# EAGLE design shield (EAGLE 8.4.0)
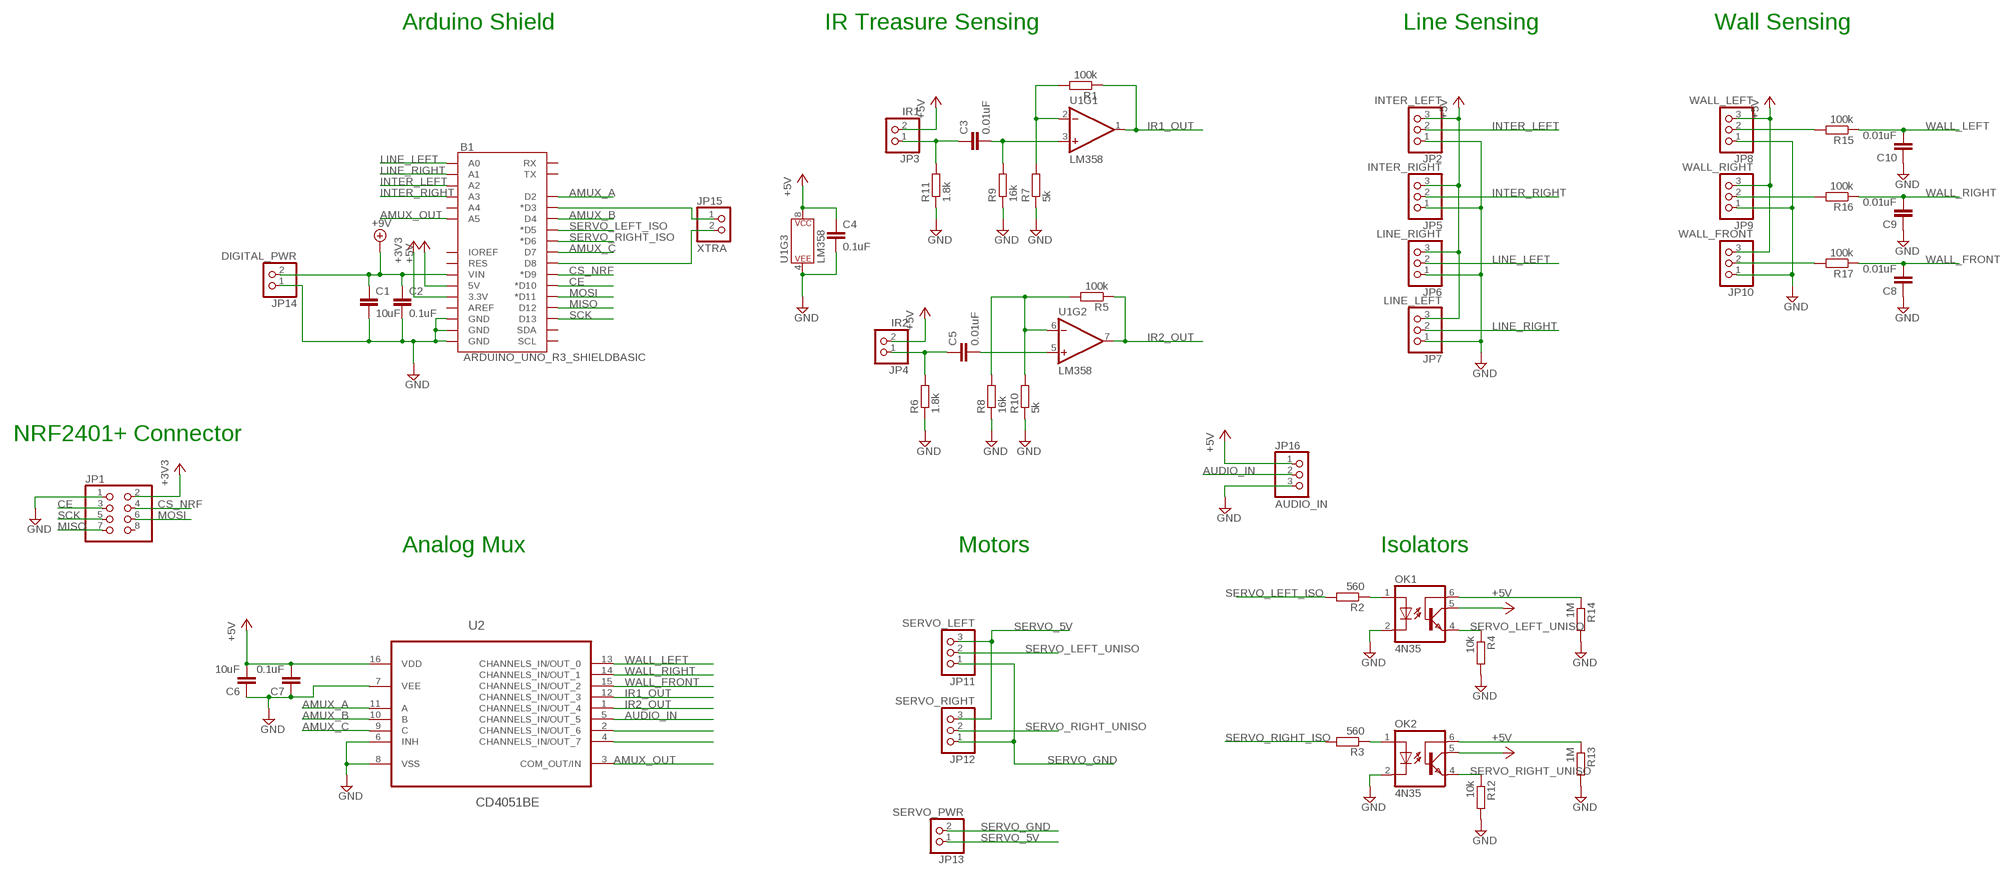
[diagram p0: schematic, sheet 1]

## Parts
B1  ARDUINO_UNO_R3_SHIELDBASIC  [UNO_R3_SHIELD]
C1  10uF  C5/3  [C5B3]
C2  0.1uF  C5/3  [C5B3]
C3  0.01uF  C5/3  [C5B3]
C4  0.1uF  C2.5/2  [C2.5-2]
C5  0.01uF  C5/3  [C5B3]
C6  10uF  C5/3  [C5B3]
C7  0.1uF  C5/3  [C5B3]
C8  0.01uF  C5/3  [C5B3]
C9  0.01uF  C5/3  [C5B3]
C10  0.01uF  C5/3  [C5B3]
JP1  PINHD-2X4  [2X04]
JP2  INTER_LEFT  PINHD-1X3  [1X03]
JP3  IR1  PINHD-1X2  [1X02]
JP4  IR2  PINHD-1X2  [1X02]
JP5  INTER_RIGHT  PINHD-1X3  [1X03]
JP6  LINE_RIGHT  PINHD-1X3  [1X03]
JP7  LINE_LEFT  PINHD-1X3  [1X03]
JP8  WALL_LEFT  PINHD-1X3  [1X03]
JP9  WALL_RIGHT  PINHD-1X3  [1X03]
JP10  WALL_FRONT  PINHD-1X3  [1X03]
JP11  SERVO_LEFT  PINHD-1X3  [1X03]
JP12  SERVO_RIGHT  PINHD-1X3  [1X03]
JP13  SERVO_PWR  PINHD-1X2  [1X02]
JP14  DIGITAL_PWR  PINHD-1X2  [1X02]
JP15  XTRA  PINHD-1X2  [1X02]
JP16  AUDIO_IN  PINHD-1X3  [1X03]
OK1  4N35  [DIL06]
OK2  4N35  [DIL06]
R1  100k  R-EU_VMTA55  [VMTA55]
R2  560  R-EU_VMTA55  [VMTA55]
R3  560  R-EU_VMTA55  [VMTA55]
R4  10k  R-EU_VMTA55  [VMTA55]
R5  100k  R-EU_VMTA55  [VMTA55]
R6  1.8k  R-EU_VMTA55  [VMTA55]
R7  5k  R-EU_VMTA55  [VMTA55]
R8  16k  R-EU_VMTA55  [VMTA55]
R9  16k  R-EU_VMTA55  [VMTA55]
R10  5k  R-EU_VMTA55  [VMTA55]
R11  1.8k  R-EU_VMTA55  [VMTA55]
R12  10k  R-EU_VMTA55  [VMTA55]
R13  1M  R-EU_VMTA55  [VMTA55]
R14  1M  R-EU_VMTA55  [VMTA55]
R15  100k  R-EU_VMTA55  [VMTA55]
R16  100k  R-EU_VMTA55  [VMTA55]
R17  100k  R-EU_VMTA55  [VMTA55]
U1  LM358  [DIP08]
U2  CD4051BE  [DIP254P762X508-16]

## Nets
+3V3: B1.3.3V JP1.2
+5V: B1.5V C4.1 C6.2 C7.2 JP2.3 JP3.2 JP4.2 JP5.3 JP6.3 JP7.3 JP8.3 JP9.3 JP10.3 JP16.1 OK1.5(COL) OK2.5(COL) U1.8(P$V+) U2.16(VDD)
AMUX_A: B1.D2 U2.11(A)
AMUX_B: B1.D4 U2.10(B)
AMUX_C: B1.D7 U2.9(C)
AMUX_OUT: B1.A5 U2.3(COM_OUT/IN)
AUDIO_IN: JP16.2 U2.5(CHANNELS_IN/OUT_5)
CE: B1.D10(*D10) JP1.3
CS_NRF: B1.D9(*D9) JP1.4
GND: B1.GND@0(GND) B1.GND@1(GND) B1.GND@2(GND) C1.2 C2.2 C4.2 C6.1 C7.1 C8.1 C9.1 C10.1 JP1.1 JP2.1 JP5.1 JP6.1 JP7.1 JP8.1 JP9.1 JP10.1 JP14.1 JP16.3 OK1.2(C) OK2.2(C) R4.2 R6.1 R7.1 R8.1 R9.1 R10.1 R11.1 R12.2 R13.2 R14.2 U1.4(P$V-) U2.6(INH) U2.7(VEE) U2.8(VSS)
INTER_LEFT: B1.A2 JP2.2
INTER_RIGHT: B1.A3 JP5.2
IR1_OUT: R1.1 U1.1(OUT) U2.12(CHANNELS_IN/OUT_3)
IR2_OUT: R5.1 U1.7(OUT) U2.1(CHANNELS_IN/OUT_4)
LINE_LEFT: B1.A0 JP6.2
LINE_RIGHT: B1.A1 JP7.2
MISO: B1.D12 JP1.7
MOSI: B1.D11(*D11) JP1.6
N$1: C3.1 JP3.1 R11.2
N$2: B1.VIN C1.1 C2.1 JP14.2 ; supply symbol labelled +9V
N$3: C3.2 R9.2 U1.3(+IN)
N$4: R1.2 R7.2 U1.2(-IN)
N$5: C5.1 JP4.1 R6.2
N$6: C5.2 U1.5(+IN)
N$7: R5.2 R8.2 R10.2 U1.6(-IN)
N$8: OK1.6(BAS) R14.1
N$9: B1.D3(*D3) JP15.1
N$10: OK2.1(A) R3.1
N$11: OK1.1(A) R2.1
N$12: B1.D8 JP15.2
N$13: JP8.2 R15.2
N$14: OK2.6(BAS) R13.1
N$16: U2.2(CHANNELS_IN/OUT_6)
N$17: U2.4(CHANNELS_IN/OUT_7)
N$18: JP9.2 R16.2
N$19: JP10.2 R17.2
SCK: B1.D13 JP1.5
SERVO_5V: JP11.3 JP12.3 JP13.1
SERVO_GND: JP11.1 JP12.1 JP13.2
SERVO_LEFT_ISO: B1.D5(*D5) R2.2
SERVO_LEFT_UNISO: JP11.2 OK1.4(EMI) R4.1
SERVO_RIGHT_ISO: B1.D6(*D6) R3.2
SERVO_RIGHT_UNISO: JP12.2 OK2.4(EMI) R12.1
WALL_FRONT: C8.2 R17.1 U2.15(CHANNELS_IN/OUT_2)
WALL_LEFT: C10.2 R15.1 U2.13(CHANNELS_IN/OUT_0)
WALL_RIGHT: C9.2 R16.1 U2.14(CHANNELS_IN/OUT_1)
Unconnected: B1.A4 B1.AREF B1.IOREF B1.RES B1.RX B1.SCL B1.SDA B1.TX JP1.8

## Notes on the sheet
- Arduino Shield | IR Treasure Sensing | Line Sensing | Wall Sensing
- NRF2401+ Connector
- Analog Mux | Motors | Isolators

## Library data of the parts
B1 = SparkFun-Boards:ARDUINO_UNO_R3_SHIELD: Arduino R3 Shield Footprint Shield form compatible with the Arduino Uno R3. SparkFun Products: MG2639 Cellular Shield <https://www.sparkfun.com/products/13120> MIDI Shield <https://www.sparkfun.com/products/12898> R3 Stackable Headers Kit <https://www.sparkfun.com/products/11417>
C1-C10 = capacitor-wima:C: CAPACITOR naming: grid - package width
JP1 = pinhead:PINHD-2X4: PIN HEADER
JP2 JP5-JP12 JP16 = pinhead:PINHD-1X3: PIN HEADER
JP3 JP4 JP13-JP15 = pinhead:PINHD-1X2: PIN HEADER
OK1 OK2 = optocoupler:4N35: MOTOROLA OPTO COUPLER; MF: FAIRCHILD SEMICONDUCTOR; MPN: 4N35; OC_FARNELL: 1328375; OC_NEWARK: 72K9946
R1-R17 = resistor:R-EU_: RESISTOR, European symbol
U1 = SparkFun-IC-Amplifiers:LM358: LM358 Jellybean op-amp Datasheet <http://www.sparkfun.com/datasheets/Components/General/LM358.pdf> SparkFun Products Op-Amp (Thru-Hole) - LM358 <https://www.sparkfun.com/products/9456> (COM-09456); PROD_ID: IC-09172
U2 = Texas Instruments_By_element14_Batch_1:CD4051BE: The CD4051B is a single 8-Channel multiplexer having three binary control inputs.; MPN: CD4051BE; OC_FARNELL: 1106109; OC_NEWARK: 60K5119; PACKAGE: PDIP-16; SUPPLIER: Texas Instruments

## Board
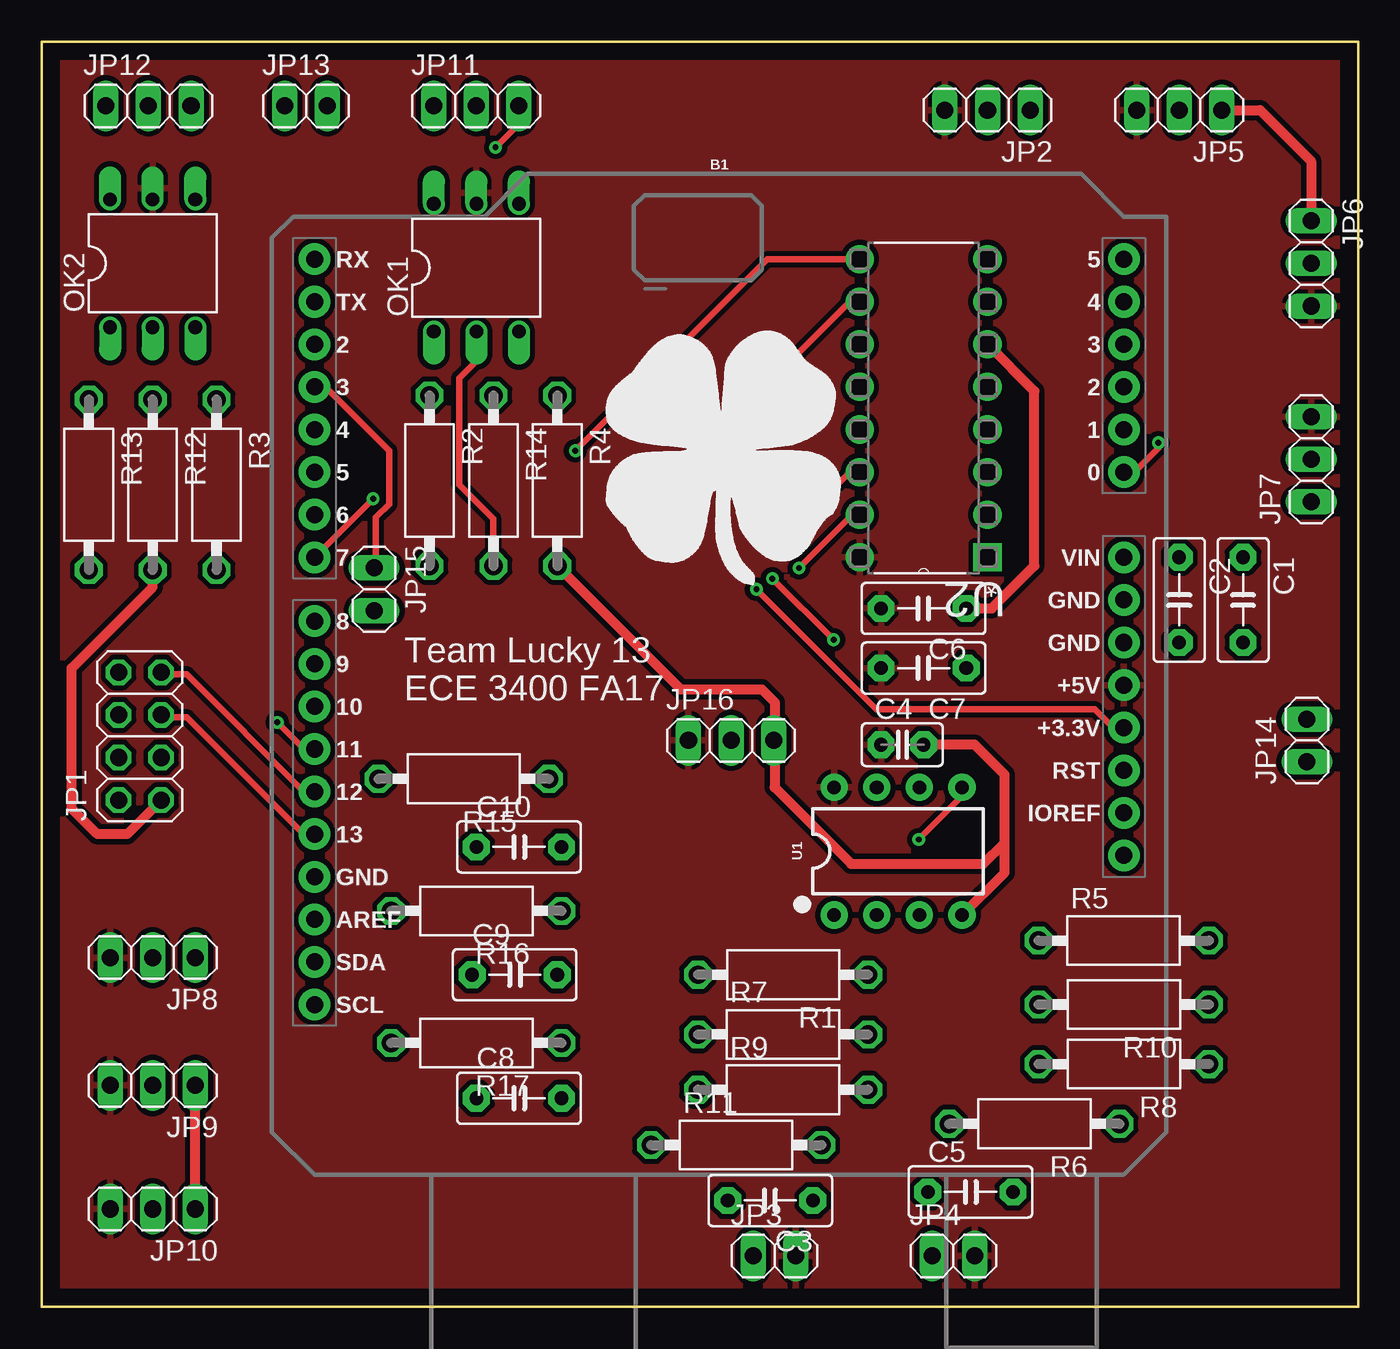
[diagram p1: board, top side]
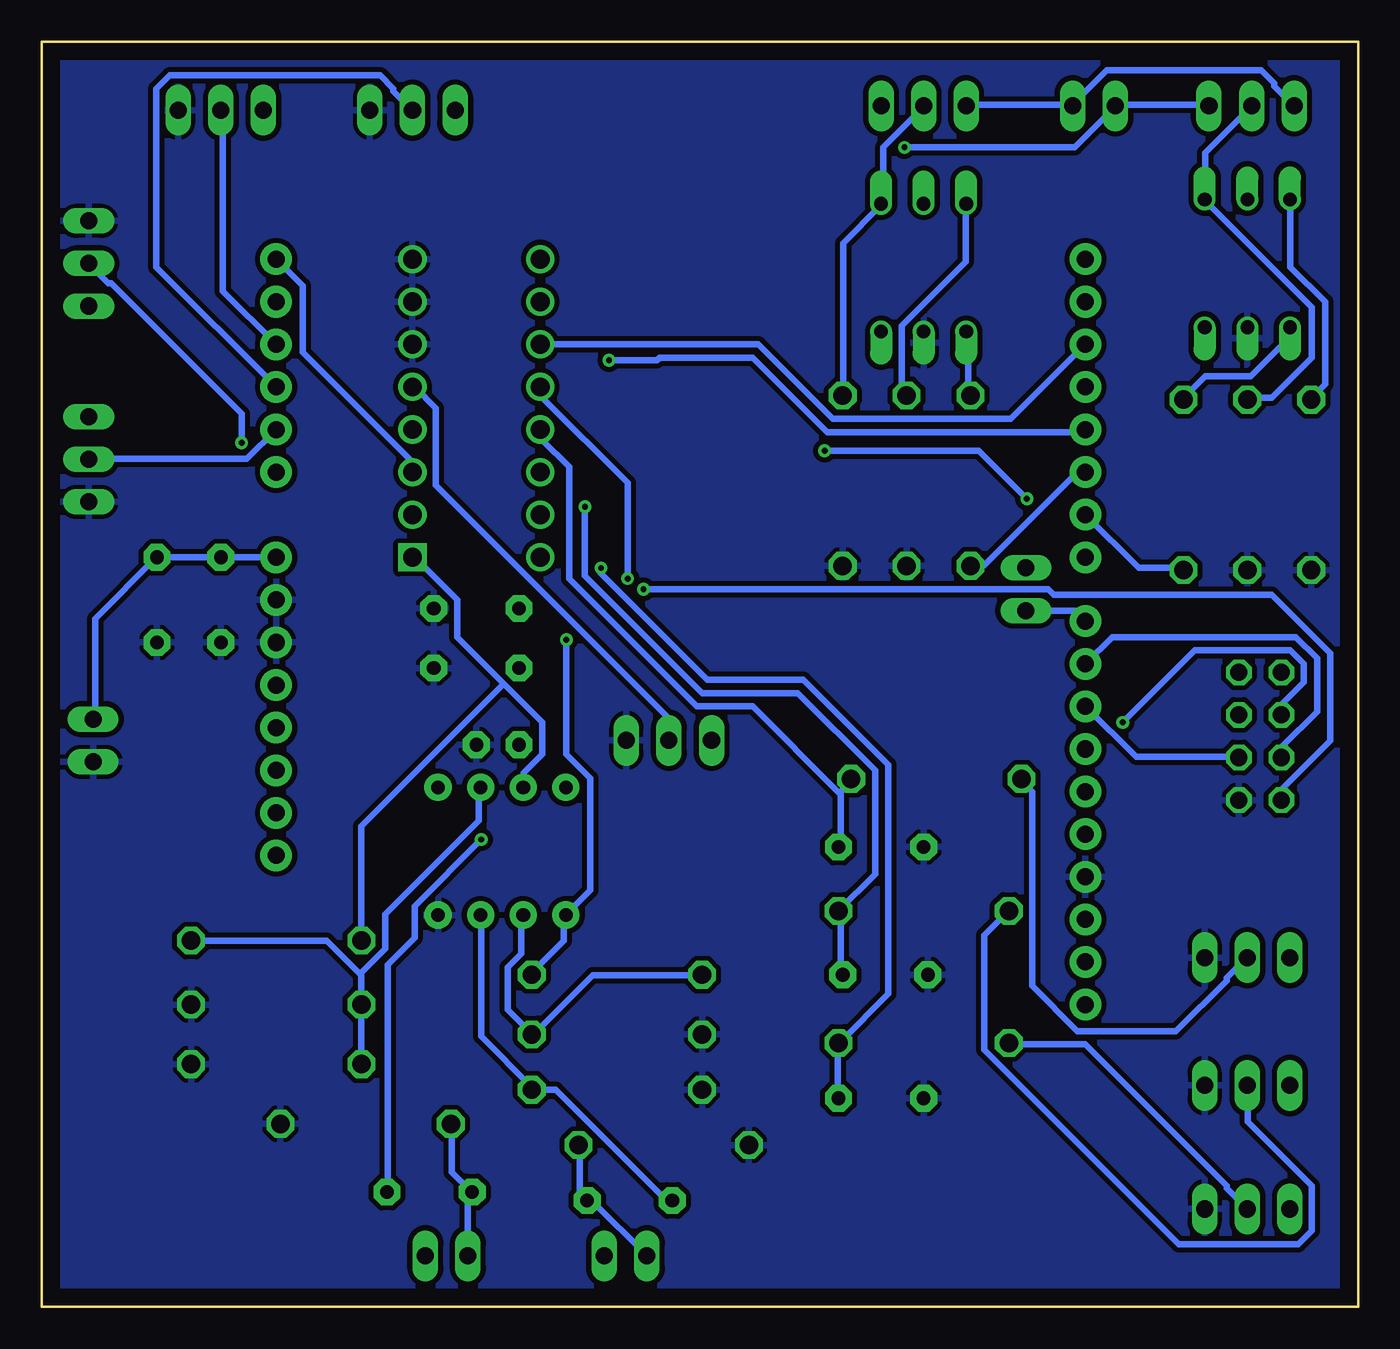
[diagram p2: board, bottom side, seen from below]

Size 78.49 x 75.44 mm. Coordinates in mm from the lower left corner, seen from the top.
Outline: 0,75.44 0,0 78.49,0 78.49,75.44 0,75.44
Copper layers (1*16): Top 0.035mm / dielectric 1.5mm / Bottom 0.035mm
Design rules "default *": minimum track width 15mil, minimum drill 0.35mm, track to track 12mil, track to pad 12mil, pad to pad 12mil, via to via 12mil, smd to smd 6mil, copper to edge 40mil, drill to drill 6mil, minimum pad ring 10mil, minimum via ring 8mil, stop-mask expansion 4mil, vias tented up to drill 0mil, thermal gap 10mil

### Footprints (pad centres in the part's own frame; a part is rotated, then mirrored left to right if it is on the bottom)
UNO_R3_SHIELD = drill 1.016 pad 1.88: 3.3V 24.13,-2.54; 5V 24.13,0; A0 24.13,12.7; A1 24.13,15.24; A2 24.13,17.78; A3 24.13,20.32; A4 24.13,22.86; A5 24.13,25.4; AREF -24.13,-13.97; D2 -24.13,20.32; D3 -24.13,17.78; D4 -24.13,15.24; D5 -24.13,12.7; D6 -24.13,10.16; D7 -24.13,7.62; D8 -24.13,3.81; D9 -24.13,1.27; D10 -24.13,-1.27; D11 -24.13,-3.81; D12 -24.13,-6.35; D13 -24.13,-8.89; GND@0 24.13,2.54; GND@1 24.13,5.08; GND@2 -24.13,-11.43; IOREF 24.13,-7.62; NC 24.13,-10.16; RES 24.13,-5.08; RX -24.13,25.4; SCL -24.13,-19.05; SDA -24.13,-16.51; TX -24.13,22.86; VIN 24.13,7.62
C5B3 = drill 0.813 pad 1.6 octagon: 1 -2.54,0; 2 2.54,0
C2.5-2 = drill 0.813 pad 1.6 octagon: 1 -1.27,0; 2 1.27,0
2X04 = drill 1.016 octagon: 1 -3.81,-1.27; 2 -3.81,1.27; 3 -1.27,-1.27; 4 -1.27,1.27; 5 1.27,-1.27; 6 1.27,1.27; 7 3.81,-1.27; 8 3.81,1.27
1X03 = drill 1.016 long: 1 -2.54,0; 2 0,0; 3 2.54,0
1X02 = drill 1.016 long: 1 -1.27,0; 2 1.27,0
DIL06 = drill 0.813 offset: 1 -2.54,-3.81; 2 0,-3.81; 3 2.54,-3.81; 4 2.54,3.81; 5 0,3.81; 6 -2.54,3.81
VMTA55 = drill 1.1 octagon: 1 -5.08,0; 2 5.08,0
DIP08 = drill 0.813 pad 1.626: 1 -3.81,-3.81; 2 -1.27,-3.81; 3 1.27,-3.81; 4 3.81,-3.81; 5 3.81,3.81; 6 1.27,3.81; 7 -1.27,3.81; 8 -3.81,3.81
DIP254P762X508-16 = drill 1.118 square: 1 -7.62,17.78 | drill 1.118: 2 -7.62,15.24; 3 -7.62,12.7; 4 -7.62,10.16; 5 -7.62,7.62; 6 -7.62,5.08; 7 -7.62,2.54; 8 -7.62,0; 9 0,0; 10 0,2.54; 11 0,5.08; 12 0,7.62; 13 0,10.16; 14 0,12.7; 15 0,15.24; 16 0,17.78

### Placement (x,y rotation side)
B1  40.39,37.08 0 top
C1  71.63,42.16 270 top
C2  67.82,42.16 270 top
C3  43.43,6.35 180 top
C4  51.31,33.53 0 top
C5  55.37,6.86 0 top
C6  52.58,41.66 180 top
C7  52.58,38.1 180 top
C8  28.45,12.45 0 top
C9  28.19,19.81 0 top
C10  28.45,27.43 0 top
JP1  5.84,34.04 90 top
JP2  56.39,71.37 180 top
JP3  43.69,3.05 0 top
JP4  54.36,3.05 0 top
JP5  67.82,71.37 180 top
JP6  75.69,62.23 270 top
JP7  75.69,50.55 90 top
JP8  6.6,20.83 180 top
JP9  6.6,13.21 180 top
JP10  6.6,5.84 180 top
JP11  25.91,71.63 0 top
JP12  6.35,71.63 0 top
JP13  15.75,71.63 0 top
JP14  75.44,33.78 90 top
JP15  19.81,42.8 270 top
JP16  41.1,33.78 0 top
OK1  25.91,61.98 0 top
OK2  6.6,62.23 0 top
R1  44.2,19.81 180 top
R2  23.11,49.28 270 top
R3  10.41,49.02 270 top
R4  30.73,49.28 270 top
R5  64.52,21.84 0 top
R6  59.18,10.92 180 top
R7  44.2,16.26 0 top
R8  64.52,14.48 180 top
R9  44.2,12.95 0 top
R10  64.52,18.03 180 top
R11  41.4,9.65 0 top
R12  6.6,49.02 270 top
R13  2.79,49.02 270 top
R14  26.92,49.28 270 top
R15  25.15,31.5 180 top
R16  25.91,23.62 180 top
R17  25.91,15.75 180 top
U1  51.05,27.18 0 top
U2  48.77,62.48 180 top

### Tracks (layer width: path | path; a pad name or v marks a point on that pad's centre or on a via)
+3V3  (via drill 0.35)
  Top 0.381: v42.61,42.8 49.75,35.66 62.77,35.66 63.88,34.54 B1.3.3V
  Bottom 0.381: v42.61,42.8 18.48,42.8 18.16,42.48 5.14,42.48 1.65,38.99 1.65,33.75 4.51,30.89 4.51,30.26 JP1.2
+5V
  pour Top: 0,75.44 0,0 78.49,0 78.49,75.44
AMUX_A
  Bottom 0.381: U2.11 35.78,57.4 31.34,52.96 20.7,52.96 B1.D2
AMUX_B  (via drill 0.35)
  Top 0.381: U2.10 48.17,59.94 v44.67,56.45
  Bottom 0.381: v44.67,56.45 41.81,56.45 41.66,56.61 36.1,56.61 31.66,52.16 16.41,52.16 B1.D4
AMUX_C  (via drill 0.35)
  Top 0.381: U2.9 43.24,62.48 v31.81,51.05 | B1.D7 v19.75,48.2
  Bottom 0.381: v31.81,51.05 22.61,51.05 v19.75,48.2
AMUX_OUT
  Bottom 0.381: B1.A5 62.93,60.9 62.93,56.93 56.42,50.42 56.42,49.78 U2.3
AUDIO_IN
  Bottom 0.381: JP16.2 41.18,33.91 41.18,35.18 54.99,48.99 54.99,53.59 56.26,54.86 U2.5
CE
  Bottom 0.381: B1.D10 13.24,32.8 7.21,32.8 JP1.3
CS_NRF
  Bottom 0.381: B1.D9 14.67,39.94 3.72,39.94 2.45,38.67 2.45,35.5 4.51,33.43 4.51,32.8 JP1.4
GND
  Top 0.381: OK1.2 25.91,56.39 24.89,55.37 24.89,49.02 26.92,46.99 R14.2
  Top 0.61: JP1.1 5.08,28.19 3.3,28.19 1.78,29.72 1.78,38.1 6.6,42.93 R12.2 | JP5.1 72.64,71.37 75.69,68.33 JP6.1 75.69,64.52 | C6.1 56.64,41.66 59.18,44.2 59.18,54.61 U2.6 | JP10.1 JP9.1 | 57.4,27.69 56.13,26.42 48.26,26.42 43.69,30.99 43.69,36.07 42.93,36.83 38.1,36.83 R4.2 | 57.4,27.69 57.4,31.75 55.63,33.53 C4.2 | U1.4 57.4,25.91 57.4,27.69
  pour Bottom: 0,75.44 0,0 78.49,0 78.49,75.44
INTER_LEFT
  Bottom 0.381: B1.A2 71.66,62.01 71.66,72.64 70.87,73.44 58.33,73.44 57.53,72.64 57.53,72.49 56.42,71.37 JP2.2
INTER_RIGHT
  Bottom 0.381: B1.A3 67.69,60.58 67.69,71.37 JP5.2
IR1_OUT  (via drill 0.35)
  Top 0.381: v47.21,39.78 v43.56,43.43
  Bottom 0.381: R1.1 49.28,19.94 47.37,21.84 47.37,23.27 U1.1 47.21,23.43 45.78,24.86 45.78,31.53 47.21,32.96 v47.21,39.78 | v43.56,43.43 43.56,49.15 48.64,54.23 48.64,54.86 U2.12
IR2_OUT
  Bottom 0.381: 50.94,37.16 53.72,39.94 53.72,42.16 56.26,44.7 U2.1 | 50.94,37.16 48.64,34.86 48.64,32.96 49.75,31.84 49.75,31.05 U1.7 | R5.1 59.44,28.67 50.94,37.16
LINE_LEFT  (via drill 0.35)
  Top 0.381: v66.58,51.53 66.58,51.21 65.15,49.78 B1.A0
  Bottom 0.381: JP6.2 74.52,61.05 74.36,61.05 66.58,53.28 v66.58,51.53
LINE_RIGHT
  Bottom 0.381: B1.A1 66.26,50.58 75.63,50.58 JP7.2
MISO
  Top 0.381: B1.D12 15.62,30.73 8.64,37.72 7.21,37.72 JP1.7
MOSI  (via drill 0.35)
  Top 0.381: v14.03,34.86 15.62,33.27 B1.D11
  Bottom 0.381: v14.03,34.86 9.75,39.15 4.03,39.15 3.24,38.35 3.24,37.24 4.51,35.97 4.51,35.34 JP1.6
N$1
  Bottom 0.381: JP3.1 42.45,3.11 45.62,6.29 45.94,6.29 C3.1 46.1,6.45 46.42,6.76 46.42,9.62 R11.2
N$2
  Bottom 0.381: B1.VIN C2.1 C1.1 71.66,44.7 75.31,41.05 75.31,35.18 JP14.2
N$3
  Bottom 0.381: C3.2 41.02,6.45 41.34,6.45 47.85,12.95 R9.2 49.28,13.11 52.29,16.13 52.29,23.27 U1.3
N$4
  Bottom 0.381: U1.2 49.91,23.27 49.91,21.05 50.7,20.26 50.7,17.72 49.28,16.29 R7.2 49.12,16.29 45.62,19.78 39.12,19.78 R1.2
N$5
  Bottom 0.381: JP4.1 53.09,6.6 C5.1 52.93,6.92 54.04,8.03 54.04,10.89 R6.2
N$6  (via drill 0.35)
  Top 0.381: v52.29,27.88 54.83,30.42 54.83,30.89 U1.5
  Bottom 0.381: v52.29,27.88 56.26,23.91 56.26,22 57.85,20.41 57.85,6.92 C5.2
N$7
  Bottom 0.381: 59.44,19.94 58.01,21.37 58.01,23.43 52.45,28.99 52.45,30.89 U1.6 | 59.44,19.94 R10.2 R8.2 | R5.2 61.5,21.84 59.59,19.94 59.44,19.94
N$8
  Bottom 0.381: OK1.6 23.4,65.66 23.4,62.32 27.21,58.52 27.21,54.55 27.05,54.39 R14.1
N$9
  Top 0.381: B1.D3 16.89,54.86 20.7,51.05 20.7,47.88 19.91,47.09 19.91,44.07 JP15.1
N$10
  Bottom 0.381: OK2.1 4.19,58.36 4.19,57.72 6.41,55.5 9.11,55.5 10.38,54.23 R3.1
N$11
  Bottom 0.381: OK1.1 23.24,58.04 23.24,54.39 R2.1
N$12
  Bottom 0.381: JP15.2 16.89,41.53 B1.D8
N$13
  Bottom 0.381: JP8.2 6.73,20.73 7.84,19.62 7.84,19.46 10.86,16.45 16.73,16.45 19.43,19.15 19.43,30.73 20.07,31.37 R15.2
N$14
  Bottom 0.381: OK2.6 4.03,65.98 4.03,62.01 1.97,59.94 1.97,55.02 2.76,54.23 R13.1
N$18
  Bottom 0.381: R16.2 22.29,22.16 22.29,15.34 10.7,3.75 3.56,3.75 2.76,4.54 2.76,7.24 6.57,11.05 6.57,13.11 JP9.2
N$19
  Bottom 0.381: JP10.2 7.84,7.08 7.84,7.24 16.26,15.65 20.7,15.65 R17.2
SCK
  Top 0.381: B1.D13 15.62,28.19 8.64,35.18 7.21,35.18 JP1.5
SERVO_5V  (via drill 0.35)
  Top 0.381: v27.05,69.15 28.32,70.42 28.32,71.53 JP11.3
  Bottom 0.381: JP12.3 8.95,71.69 14.35,71.69 JP13.1 14.51,71.53 16.89,69.15 v27.05,69.15
SERVO_GND
  Bottom 0.381: JP12.1 4.98,72.8 4.98,72.96 5.78,73.75 14.99,73.75 17.05,71.69 JP13.2 17.21,71.69 23.24,71.69 JP11.1
SERVO_LEFT_ISO
  Bottom 0.381: B1.D5 16.73,49.78 22.29,44.23 23.08,44.23 R2.2
SERVO_LEFT_UNISO
  Bottom 0.381: JP11.2 25.94,71.53 28.32,69.15 28.32,65.82 OK1.4 28.48,65.66 30.7,63.44 30.7,54.39 R4.1
SERVO_RIGHT_ISO
  Bottom 0.381: B1.D6 13.08,44.07 10.54,44.07 R3.2
SERVO_RIGHT_UNISO
  Bottom 0.381: JP12.2 6.41,71.53 9.11,68.83 9.11,66.13 OK2.4 9.11,65.98 2.76,59.63 2.76,56.61 5.14,54.23 6.57,54.23 R12.1
WALL_FRONT  (via drill 0.35)
  Top 0.381: U2.15 48.32,47.24 v45.15,44.07
  Bottom 0.381: C8.2 31.02,12.48 31.02,15.65 R17.1 30.86,15.81 28,18.67 28,32.32 33.08,37.4 38.8,37.4 45.15,43.75 v45.15,44.07
WALL_LEFT
  Bottom 0.381: 30.86,30.73 30.86,27.56 C10.2 | 30.86,30.73 30.23,31.37 R15.1 | U2.13 48.64,52.32 48.64,51.69 47.05,50.1 47.05,43.43 39.43,35.81 36.1,35.81 31.02,30.73 30.86,30.73
WALL_RIGHT  (via drill 0.35)
  Top 0.381: U2.14 48.17,49.78 v46.1,47.72
  Bottom 0.381: C9.2 30.86,19.94 30.86,23.59 R16.1 28.8,25.81 28.8,32 33.4,36.61 39.12,36.61 46.1,43.59 v46.1,47.72

### Text on the board
tPlace: C:/Users/gcfla/Downloads/four-leaf-clover-black-hi.bmp | Team Lucky 13 / ECE 3400 FA17